# Altium project PCB_ProjectIE1.PrjPcb
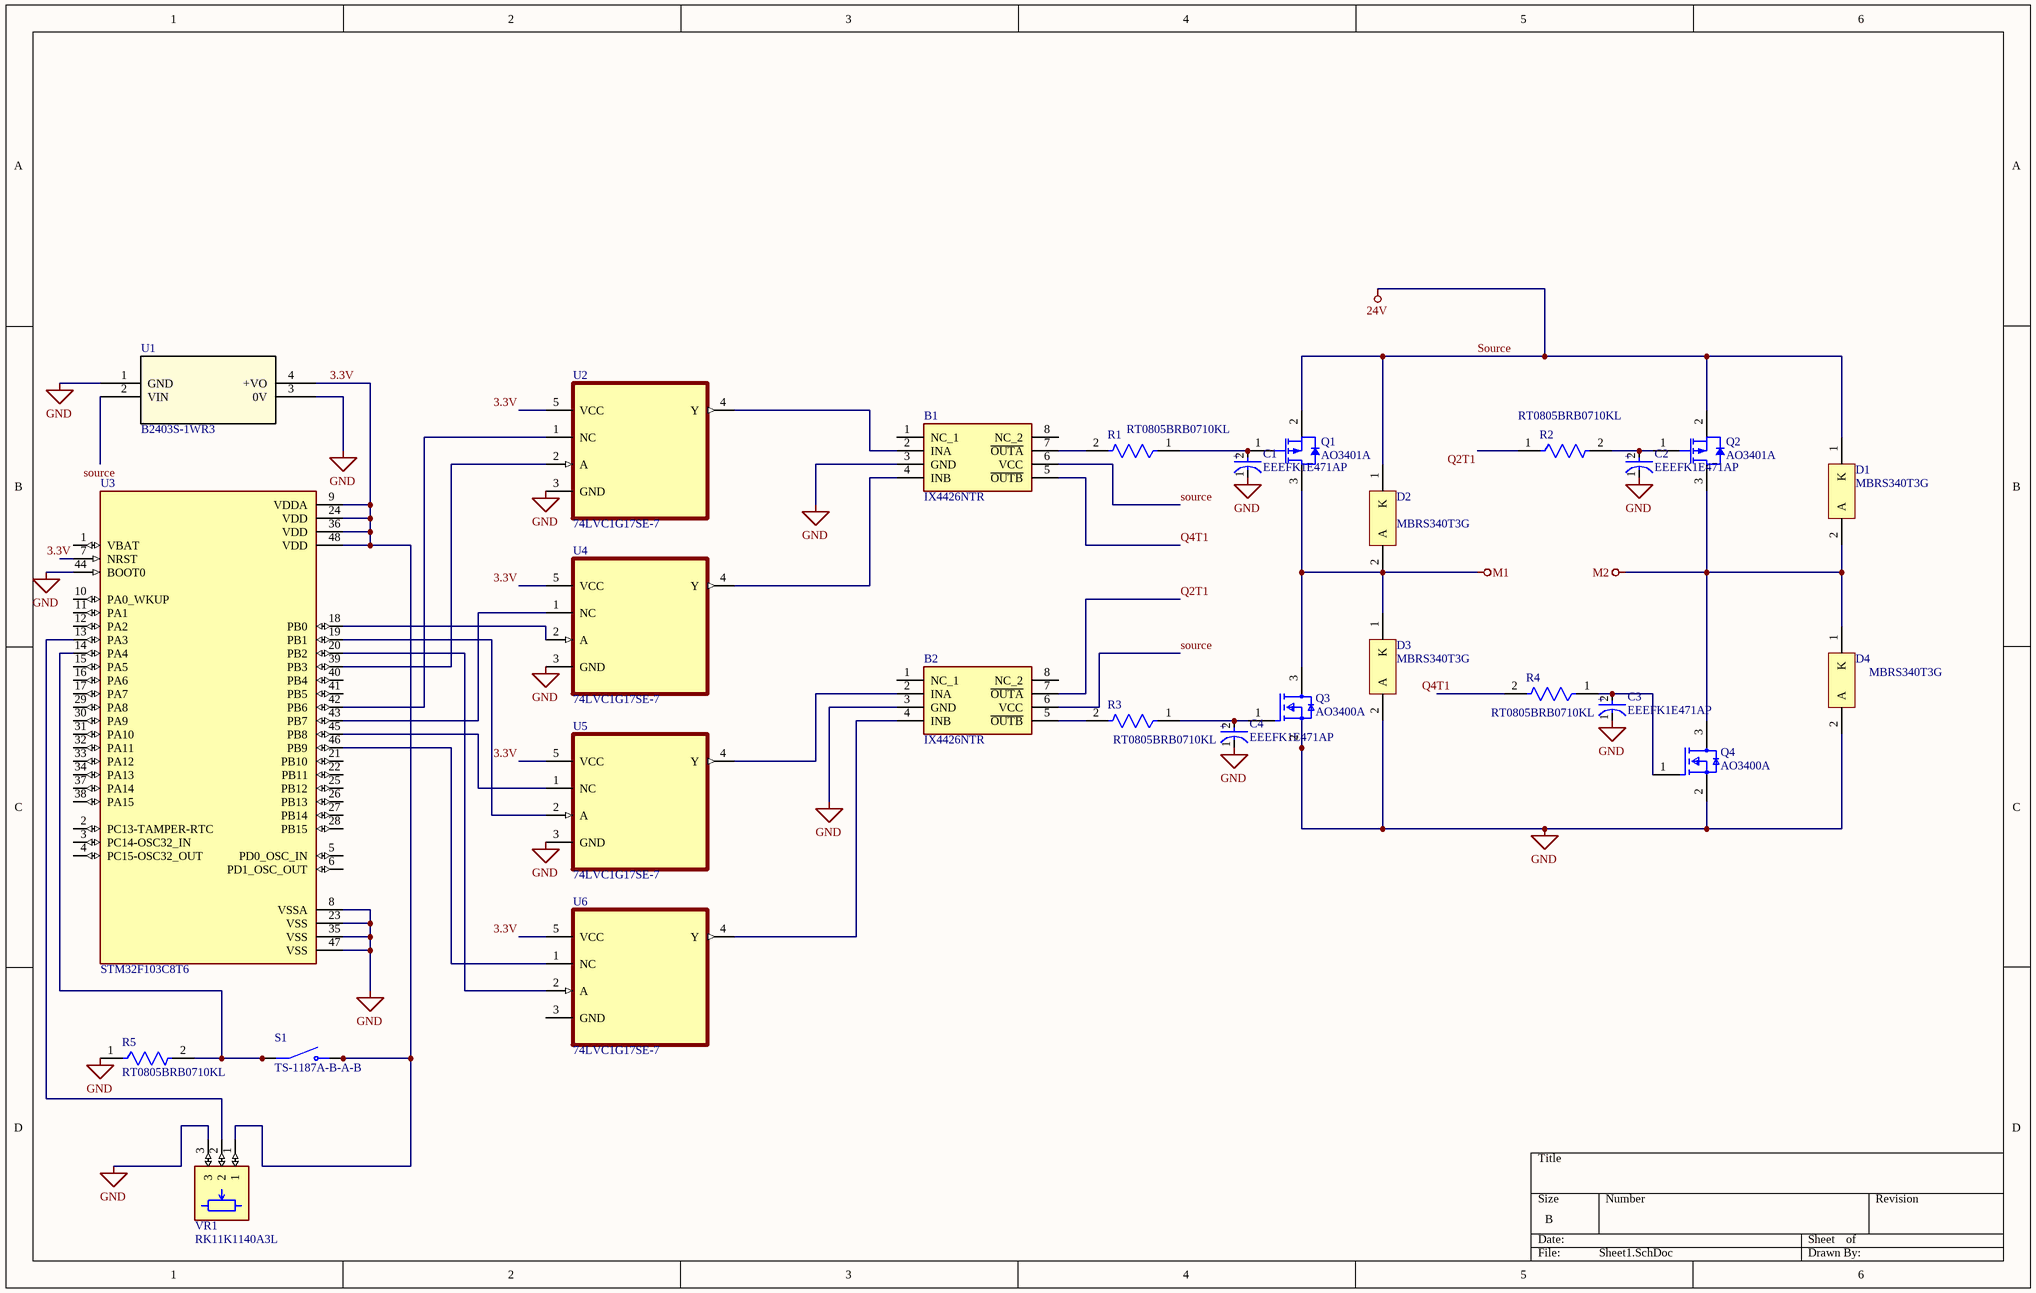
[diagram p0: Sheet1.SchDoc]
1 sheet, 27 parts. Net scope: global (net labels, ports and power ports of the same name join across sheets).
Board file: PCB_PorjectIE1.PcbDoc

## Sheet Sheet1.SchDoc
size B; SheetNumber: 1; SheetTotal: 1

### Parts
B1  IX4426NTR  [SOIC127P600X175-8N]
B2  IX4426NTR  [SOIC127P600X175-8N]
C1  EEEFK1E471AP  [FP-FKG-MFG]
C2  EEEFK1E471AP  [FP-FKG-MFG]
C3  EEEFK1E471AP  [FP-FKG-MFG]
C4  EEEFK1E471AP  [FP-FKG-MFG]
D1  MBRS340T3G  [ONSC-SMC-2-403-03_V]
D2  MBRS340T3G  [ONSC-SMC-2-403-03_V]
D3  MBRS340T3G  [ONSC-SMC-2-403-03_V]
D4  MBRS340T3G  [ONSC-SMC-2-403-03_V]
Q1  AO3401A  [AO-SOT-23-3L_V]
Q2  AO3401A  [AO-SOT-23-3L_V]
Q3  AO3400A  [FP-SOT23-MFG]
Q4  AO3400A  [FP-SOT23-MFG]
R1  RT0805BRB0710KL  [FP-RT0805-MFG]
R2  RT0805BRB0710KL  [FP-RT0805-MFG]
R3  RT0805BRB0710KL  [FP-RT0805-MFG]
R4  RT0805BRB0710KL  [FP-RT0805-MFG]
R5  RT0805BRB0710KL  [FP-RT0805-MFG]
S1  TS-1187A-B-A-B  [SW_TS-1187A-B-A-B]
U1  B2403S-1WR3  [SIP4_B_S-1WR3_MNS]
U2  74LVC1G17SE-7  [SOT65P210X110-5N]
U3  STM32F103C8T6  [QFP50P900X900X160-48N]
U4  74LVC1G17SE-7  [SOT65P210X110-5N]
U5  74LVC1G17SE-7  [SOT65P210X110-5N]
U6  74LVC1G17SE-7  [SOT65P210X110-5N]
VR1  RK11K1140A3L  [RK11K1140A3L]

### Nets
GND: B1.3(GND) B2.3(GND) C1.1(C) C2.1(C) C3.1(C) C4.1(C) D3.2(A) D4.2(A) Q3.2(S) Q4.2(S) R5.1 U1.1(GND) U1.3(0V) U2.3(GND) U3.8(VSSA) U3.23(VSS) U3.35(VSS) U3.44(BOOT0) U3.47(VSS) U4.3(GND) U5.3(GND) VR1.3
M1: D2.2(A) D3.1(K) Q1.3(DRAIN) Q3.3(D)
M2: D1.2(A) D4.1(K) Q2.3(DRAIN) Q4.3(D)
Source: B1.6(VCC) B2.6(VCC) D1.1(K) D2.1(K) Q1.2(SOURCE) Q2.2(SOURCE) U1.2(VIN)  [also labelled 24V]
3.3V: S1.C(NO) S1.D(NO) U1.4(+VO) U2.5(VCC) U3.7(NRST) U3.9(VDDA) U3.24(VDD) U3.36(VDD) U3.48(VDD) U4.5(VCC) U5.5(VCC) U6.5(VCC) VR1.1
Q2T1: B2.7(~{OUTA}) R2.1
Q4T1: B1.5(~{OUTB}) R4.2
NetB1_2: B1.2(INA) U2.4(Y)
NetB1_4: B1.4(INB) U4.4(Y)
NetB1_7: B1.7(~{OUTA}) R1.2
NetB2_2: B2.2(INA) U5.4(Y)
NetB2_4: B2.4(INB) U6.4(Y)
NetB2_5: B2.5(~{OUTB}) R3.2
NetC1_2: C1.2(A) Q1.1(GATE) R1.1
NetC2_2: C2.2(A) Q2.1(GATE) R2.2
NetC3_2: C3.2(A) Q4.1(G) R4.1
NetC4_2: C4.2(A) Q3.1(G) R3.1
NetR5_2: R5.2 S1.A(COM) S1.B(COM) U3.14(PA4)
NetU2_1: U2.1(NC) U3.42(PB6)
NetU2_2: U2.2(A) U3.39(PB3)
NetU3_13: U3.13(PA3) VR1.2
NetU3_18: U3.18(PB0) U4.2(A)
NetU3_19: U3.19(PB1) U5.2(A)
NetU3_20: U3.20(PB2) U6.2(A)
NetU3_43: U3.43(PB7) U4.1(NC)
NetU3_45: U3.45(PB8) U5.1(NC)
NetU3_46: U3.46(PB9) U6.1(NC)

Not connected (* = marked no-connect by the designer): B1 1(NC_1) 8(NC_2); B2 1(NC_1) 8(NC_2); U3 1(VBAT) 2(PC13-TAMPER-RTC) 3(PC14-OSC32_IN) 4(PC15-OSC32_OUT) 5(PD0_OSC_IN) 6(PD1_OSC_OUT) 10(PA0_WKUP) 11(PA1) 12(PA2) 15(PA5) 16(PA6) 17(PA7) 21(PB10) 22(PB11) 25(PB12) 26(PB13) 27(PB14) 28(PB15) 29(PA8) 30(PA9) 31(PA10) 32(PA11) 33(PA12) 34(PA13) 37(PA14) 38(PA15) 40(PB4) 41(PB5); U6 3(GND)

### Notes on the sheet
- (in symbol CMP-00287-05389189-1) +

### Library data of the parts
B1 B2 = IX4426NTR: Gate Drivers Dual MOSFET DRVR 8P SOIC Input CMOS; Manufacturer_Name: LITTELFUSE; Geometry.Height: 1.75mm; Manufacturer_Part_Number: IX4426NTR; Mouser Part Number: 849-IX4426NTR; Mouser Price/Stock: https://www.mouser.co.uk/ProductDetail/IXYS-Integrated-Circuits/IX4426NTR?qs=QbteAPZ0mr0LY90Ss3r74Q%3D%3D; Arrow Part Number: IX4426NTR; Arrow Price/Stock: https://www.arrow.com/en/products/ix4426ntr/littelfuse?utm_currency=USD&region=nac; Datasheet Link: https://www.arrow.com/en/products/ix4426ntr/ixys
C1-C4 = CMP-00287-05389189-1: EEEFK1E471AP Aluminum Electrolytic Capacitor, 470 uF, 25 V, ± 20%, 2000 hours @ 105°C, Radial Can - SMD; Capacitance: 470µF; Voltage: 25V; Ripple Current: 850mA; Lead Length: 3.5mm; Dissipation Factor: 0.14%; Dielectric Material: Aluminium; ESR (Equivalent Series Resistance): 80mΩ; Leakage Current: 117.5µA; Packaging: Cut Tape; Schedule B: 8532220020, 8532220020; Lead Pitch: 4.6mm; Life (Hours): 2000hours; Radiation Hardening: No; Diameter: 10mm; Ripple Current (AC): 850mA; Lifecycle Status: Production; Min Operating Temperature: -55°C; Height: 10.2mm; Number of Pins: 2; Lead Free: Lead Free; Width: 10.3mm; REACH SVHC: Unknown; RoHS: Compliant; Voltage Rating (DC): 25V; Tolerance: 20%; Voltage Rating (AC): 25V; Length: 10.2mm; Height - Seated (Max): 10.2108mm; Contact Plating: Tin; Case/Package: Radial; Voltage Rating: 25V; Mount: PCB, Surface Mount; NexarPartId: 5389189; Max Operating Temperature: 105°C; Impedance: 80mΩ; Termination: SMD/SMT
D1-D4 = CMP-1055-00380-1: Schottky Power Rectifier, 2-Pin SMC, Pb-Free, Tape and Reel; Manufacturer: On Semiconductor; Configuration: Single; IFSM Max (A): 80; ComponentLink3Description: Package Specification; ComponentLink1Description: Manufacturer URL; DatasheetVersion: Rev. 11; PackageDescription: 2-Pin Small Molded Package, J-Bend Lead, Body 5.845 x 6.855 mm; PackageVersion: Rev. E, 08/2005; RoHS: TRUE; Packing: Tape and Reel; PackageReference: SMC-2-403-03; ComponentLink3URL: http://www.onsemi.com/pub_link/Collateral/403-03.PDF; ComponentLink2URL: http://www.onsemi.cn/pub_link/Collateral/MBRS340T3-D.PDF; PartNumber: MBRS340T3G; Mounting Technology: Surface Mount; ComponentLink1URL: http://www.onsemi.com/; ComponentLink2Description: Datasheet
Q1 Q2 = CMP-2000-05778-1: P-Channel MOSFET, 30 V, 4 A, -55 to 150 degC, 3-Pin SOT-23-3L, RoHS, Tape and Reel; Manufacturer: Alpha and Omega; Output Power (Max): NotRequiredW; Power Dissipation: 1.4W; Rad Hardened: No; Drain Efficiency: NotRequired%; Drain-Source On-Volt: 30V; Noise Figure: NotRequireddB; Frequency (Max): NotRequiredMHz; Number of  Elements: 1; Gate-Source Voltage (Max): ?12V; Drain Current (Max): 4A; Channel Mode: Enhancement; Drain-Source On-Res: 0.044ohm; Type: PowerMOSFET; Polarity: P; Package URL: http://www.aosmd.com/res/packaging_information/SOT-23-3L.pdf; Datasheet URL: http://www.aosmd.com/res/data_sheets/AO3401A.pdf; Package Type: SOT-23; Package Description: 3-Pin Small Outline Transistor, Body 2.95 x 1.6 mm, Pitch 0.95 mm; Mounting: SurfaceMount; Manufacturer URL: http://www.aosmd.com/; Continuous Drain Current: 4A; Package Reference: SOT-23-3L; Mounting Technology: SurfaceMount; Operating Temperature Classification: Military; Power Gain: NotRequireddB; Datasheet Version: Rev. 3, 03/2011; Operating Temp Range: -55Cto150C; Pin Count: 3
Q3 Q4 = CMP-83955-000006-1: MOSFET N-CH 30V 5.7A SOT23; Input Capacitance: 630pF; Number of Elements: 1; Rds On Max: 26.5mR; Max Power Dissipation: 1.4W; Gate to Source Voltage (Vgs): 12V; Min Operating Temperature: -55°C; Lead Free: Lead Free; Number of Pins: 3; Drain to Source Voltage (Vdss): 30V; Case/Package: SOT-23; Mount: Surface Mount; Continuous Drain Current (ID): 5.7A; Radiation Hardening: No; Packaging: Tape and Reel; Max Operating Temperature: 150°C; Power Dissipation: 1.4W
R1-R5 = CMP-2001-01710-2: RES SMD 10K OHM 0.1% 1/8W 0805; Manufacturer: Yageo; Voltage Rating: 150V; Resistance: 10KΩ; Temperature Coefficient: 10 ppm/°C; Power Rating: 0.125W; Tolerance: 0.0025; Value: 10KΩ; Digikey Description: RES SMD 10K OHM 0.1% 1/8W 0805; Manufacturer Part Number: RT0805BRB0710KL; Mouser Description: Thin Film Resistors - SMD 10K ohm 0.1% 1/8W; Lead Free: Yes; Octopart: https://octopart.com/rt0805brb0710kl-yageo-16261789; Temperature Range High: +155°C; ComponentLink2Description: Datasheet; Height: 0.6mm; Device Class L2: Resistors; Composition: Thin Film; Series: RT; Footprint Url: http://www.yageo.com/exep/pages/download/literatures/PYu-R_Mount_10.pdf; Automotive: No; Device Class L3: Chip SMD Resistors; RoHS: TRUE; Ipc Land Pattern Name: RESC200125X50; ComponentLink2URL: http://www.yageo.com/documents/recent/PYu-RT_1-to-0.01_RoHS_L_9.pdf; Temperature: -55°C to +155°C; Temperature Range Low: -55°C; Category: Res; Package: RT0805; Device Class L1: Passive Components
S1 = TS-1187A-B-A-B: SPST 50mA @ 12VDC Top Actuated Round Button 160gf SMD Tactile Switches RoHS; MP: TS-1187A-B-A-B; Value: *; Price: None; Package: None; Availability: Unavailable
U1 = B2403S-1WR3: No Description Available; Manufacturer_Name: MORNSUN; Type: DC DC Converters; Copyright: Copyright (C) 2025 Ultra Librarian. All rights reserved.; Manufacturer_Part_Number: B2403S-1WR3; RefDes: RefDes
U2 U4-U6 = 74LVC1G17SE-7: Single Schmitt-Trigger Buffer SOT-353 | Diodes Inc 74LVC1G17SE-7; MF: Diodes Inc.; SnapEDA_Link: https://www.snapeda.com/parts/74LVC1G17SE-7/Diodes+Inc./view-part/?ref=snap; Package: SOT-353 Diodes Inc.; Value: *; MP: 74LVC1G17SE-7; Check_prices: https://www.snapeda.com/parts/74LVC1G17SE-7/Diodes+Inc./view-part/?ref=eda
U3 = STM32F103C8T6: ARM® Cortex®-M3 STM32F1 Microcontroller IC 32-Bit 72MHz 64KB (64K x 8) FLASH 48-LQFP (7x7); MF: STMicroelectronics; SnapEDA_Link: https://www.snapeda.com/parts/STM32F103C8T6/STMicroelectronics/view-part/?ref=snap; Package: LQFP-48 STMicroelectronics; Value: *; MP: STM32F103C8T6; Check_prices: https://www.snapeda.com/parts/STM32F103C8T6/STMicroelectronics/view-part/?ref=eda
VR1 = RK11K1140A3L: 10k Ohm 1 Gang Linear Through Hole, Snap In Potentiometer None 1.0 Kierros 0.05W, 1/20W PC Pins, Board Locks; MF: ALPS; SnapEDA_Link: https://www.snapeda.com/parts/RK11K1140A3L/ALPS/view-part/?ref=snap; Package: None; Value: *; MP: RK11K1140A3L; Check_prices: https://www.snapeda.com/parts/RK11K1140A3L/ALPS/view-part/?ref=eda